# Altium schematic sheet 7.MINIPCIE.SchDoc
size A4
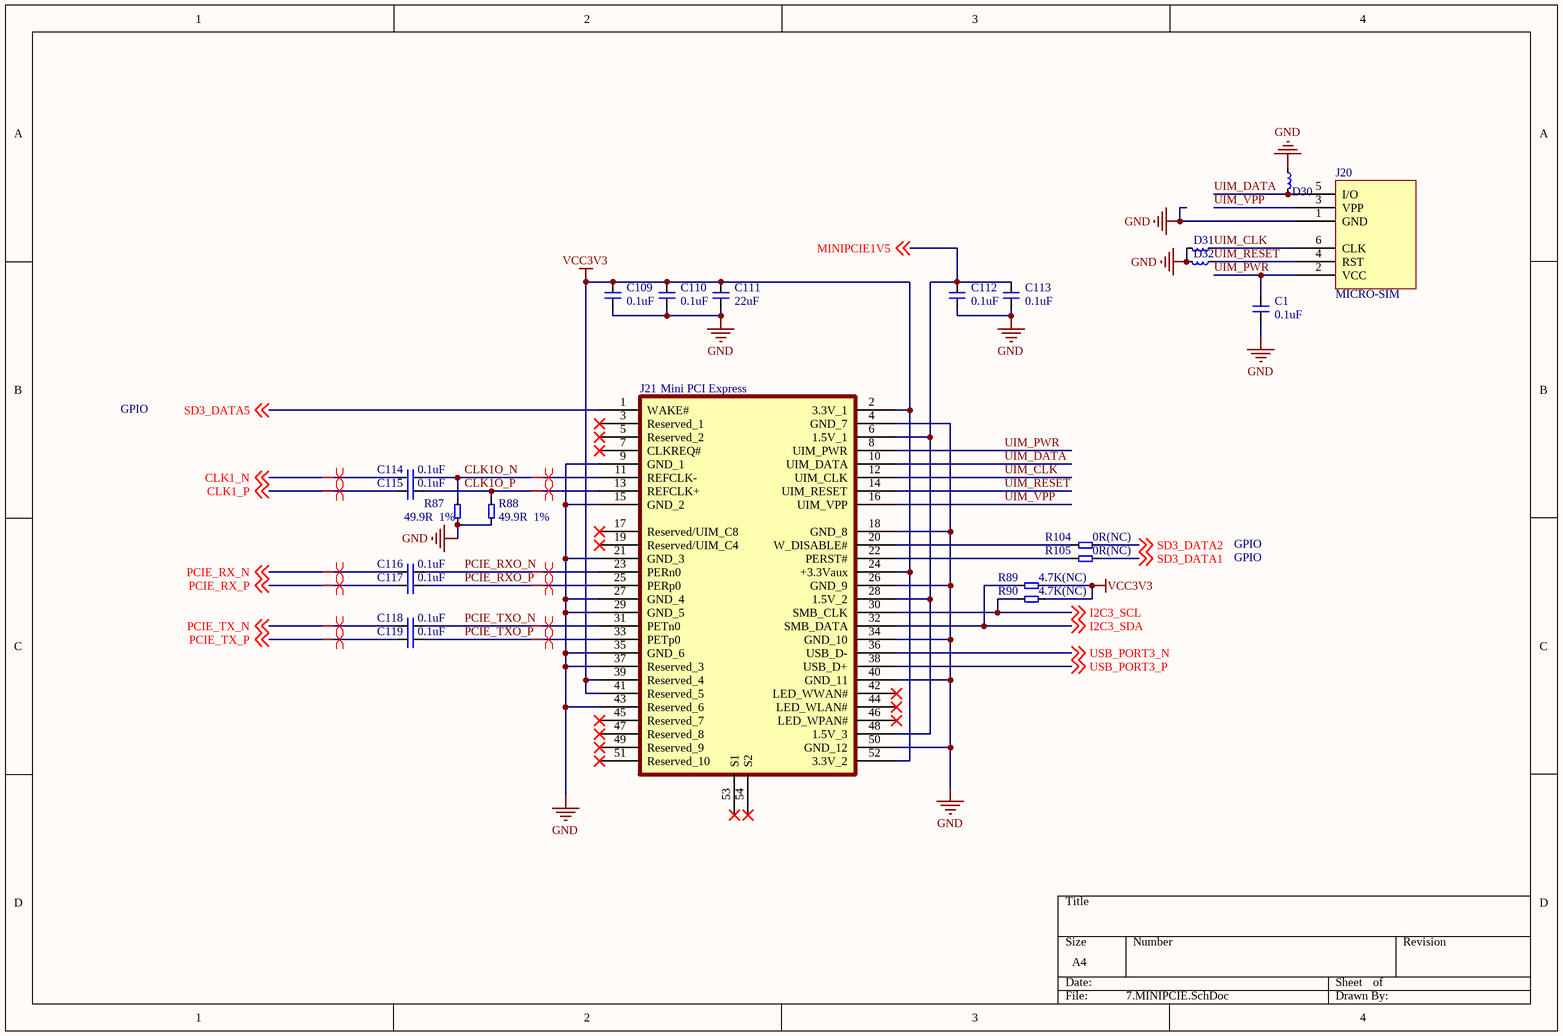
[diagram p0: 7.MINIPCIE.SchDoc]

## Parts
C1  0.1uF  [0603C]
C109  0.1uF  [0603C]
C110  0.1uF  [0603C]
C111  22uF  [0603C]
C112  0.1uF  [0603C]
C113  0.1uF  [0603C]
C114  0.1uF  [0603C]
C115  0.1uF  [0603C]
C116  0.1uF  [0603C]
C117  0.1uF  [0603C]
C118  0.1uF  [0603C]
C119  0.1uF  [0603C]
D30  ESD  [0603L]  (value not drawn)
D31  ESD  [0603L]  (value not drawn)
D32  ESD  [0603L]  (value not drawn)
J20  MICRO-SIM  [MACRO-SIM]
J21  Mini PCI Express  [MINI-PCIE]
R87  49.9R  1%  [0603R]
R88  49.9R  1%  [0603R]
R89  4.7K(NC)  [0603R]
R90  4.7K(NC)  [0603R]
R104  0R(NC)  [0603R]
R105  0R(NC)  [0603R]

## Nets
GND: C1.2 C109.2 C110.2 C111.2 C112.2 C113.2 D30.1 D31.2 D32.2 J20.1(GND) J21.4(GND_7) J21.9(GND_1) J21.15(GND_2) J21.18(GND_8) J21.21(GND_3) J21.26(GND_9) J21.27(GND_4) J21.29(GND_5) J21.34(GND_10) J21.35(GND_6) J21.37(Reserved_3) J21.40(GND_11) J21.43(Reserved_6) J21.50(GND_12) R87.1 R88.1
VCC3V3: C109.1 C110.1 C111.1 J21.2(3.3V_1) J21.24(+3.3Vaux) J21.39(Reserved_4) J21.41(Reserved_5) J21.52(3.3V_2) R89.1 R90.1
CLK1_N: C114.1 ; off-sheet CLK1_N
CLK1_P: C115.1 ; off-sheet CLK1_P
CLK1O_N: C114.2 J21.11(REFCLK-) R87.2
CLK1O_P: C115.2 J21.13(REFCLK+) R88.2
I2C3_SCL: J21.30(SMB_CLK) R90.2 ; off-sheet I2C3_SCL
I2C3_SDA: J21.32(SMB_DATA) R89.2 ; off-sheet I2C3_SDA
MINIPCIE1V5: C112.1 C113.1 J21.6(1.5V_1) J21.28(1.5V_2) J21.48(1.5V_3) ; off-sheet MINIPCIE1V5
PCIE_RX_N: C116.1 ; off-sheet PCIE_RX_N
PCIE_RX_P: C117.1 ; off-sheet PCIE_RX_P
PCIE_RXO_N: C116.2 J21.23(PERn0)
PCIE_RXO_P: C117.2 J21.25(PERp0)
PCIE_TX_N: C118.1 ; off-sheet PCIE_TX_N
PCIE_TX_P: C119.1 ; off-sheet PCIE_TX_P
PCIE_TXO_N: C118.2 J21.31(PETn0)
PCIE_TXO_P: C119.2 J21.33(PETp0)
SD3_DATA1: R105.1 ; off-sheet SD3_DATA1
SD3_DATA2: R104.1 ; off-sheet SD3_DATA2
SD3_DATA5: J21.1(WAKE#) ; off-sheet SD3_DATA5
UIM_CLK: D31.1 J20.6(CLK) J21.12(UIM_CLK)
UIM_DATA: D30.2 J20.5(I/O) J21.10(UIM_DATA)
UIM_PWR: C1.1 J20.2(VCC) J21.8(UIM_PWR)
UIM_RESET: D32.1 J20.4(RST) J21.14(UIM_RESET)
UIM_VPP: J20.3(VPP) J21.16(UIM_VPP)
USB_PORT3_N: J21.36(USB_D-) ; off-sheet USB_PORT3_N
USB_PORT3_P: J21.38(USB_D+) ; off-sheet USB_PORT3_P
NetJ21_20: J21.20(W_DISABLE#) R104.2
NetJ21_22: J21.22(PERST#) R105.2

Not connected (* = marked no-connect by the designer): J21 3(Reserved_1)* 5(Reserved_2)* 7(CLKREQ#)* 17(Reserved/UIM_C8)* 19(Reserved/UIM_C4)* 42(LED_WWAN#)* 44(LED_WLAN#)* 45(Reserved_7)* 46(LED_WPAN#)* 47(Reserved_8)* 49(Reserved_9)* 51(Reserved_10)* 53(S1)* 54(S2)*

## Layout directives
differential pair: CLK1_N, CLK1_P, CLK1O_N, CLK1O_P, PCIE_RX_N, PCIE_RX_P, PCIE_RXO_N, PCIE_RXO_P, PCIE_TX_N, PCIE_TX_P, PCIE_TXO_N, PCIE_TXO_P

## Notes on the sheet
- GPIO

## Library data of the parts
C1 C109-C119 = 电容
D30-D32 = 电感
J21 = MINIPCIE: MPC24-52K3311
R87-R90 R104 R105 = 电阻